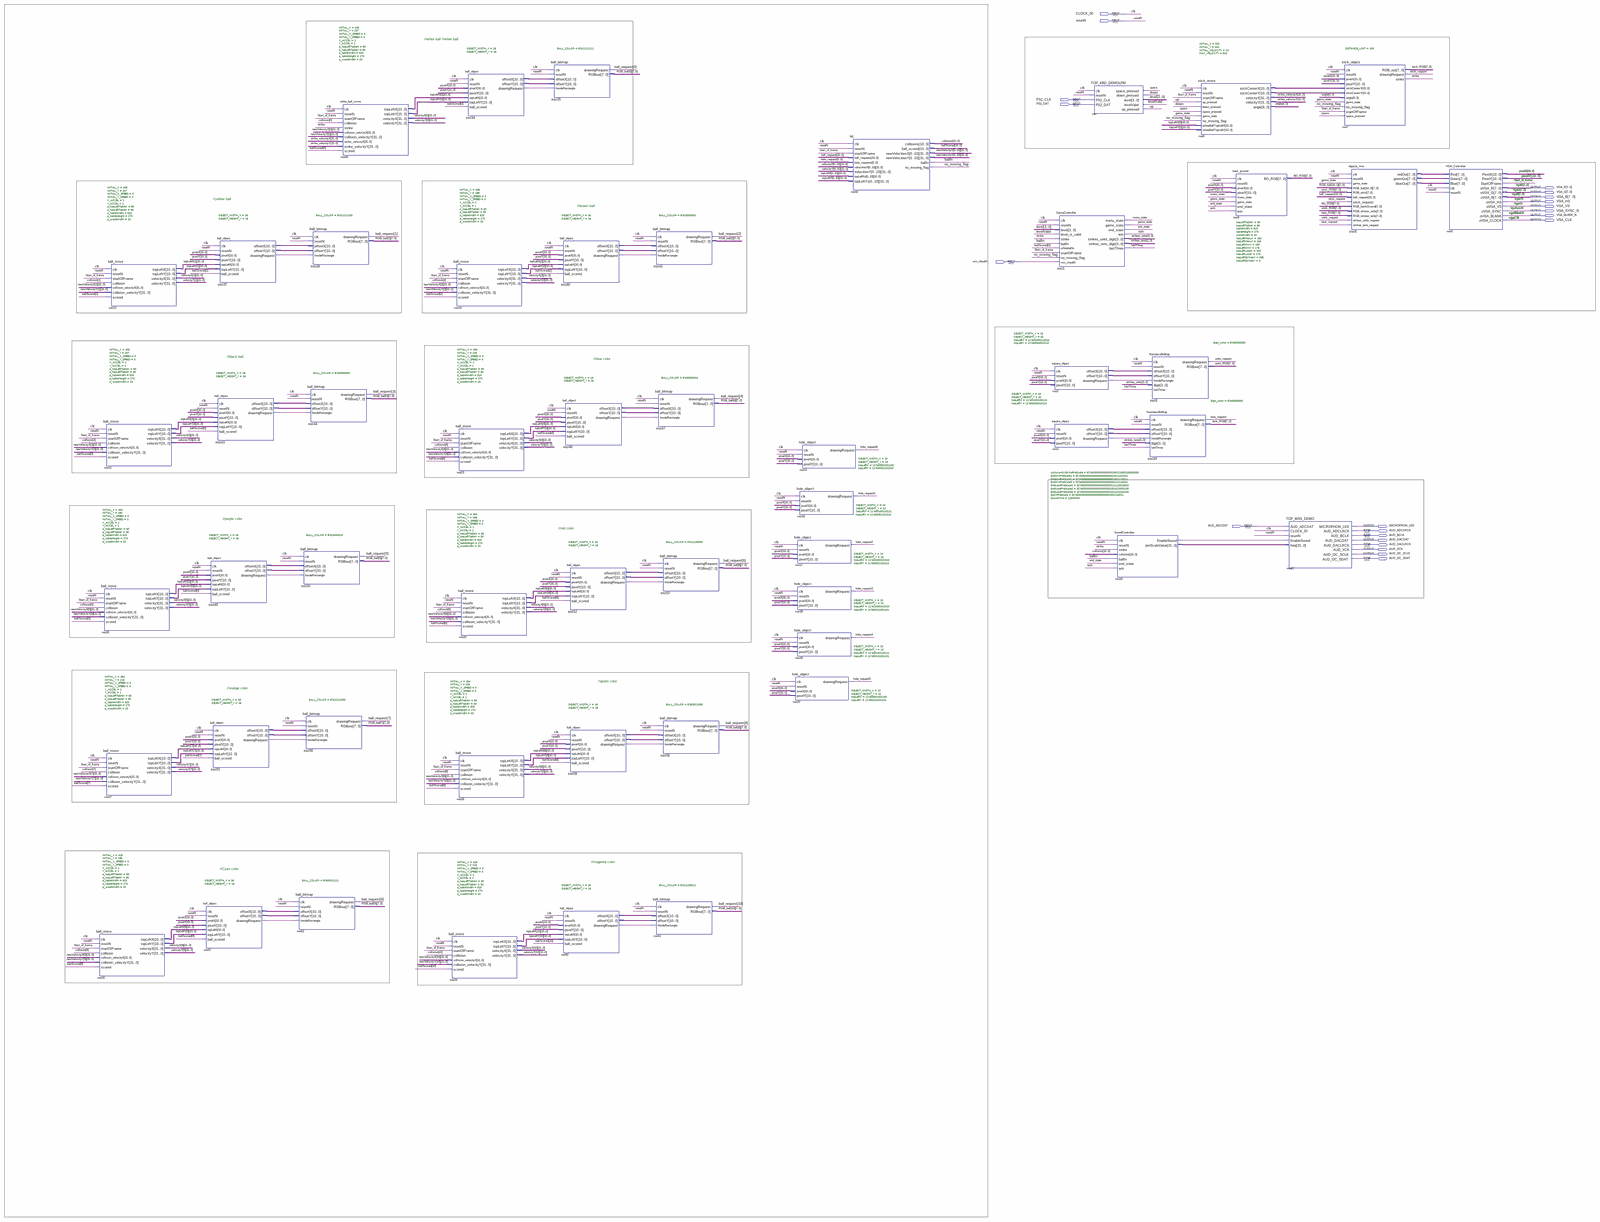
[diagram p0: schematic sheet, whole]
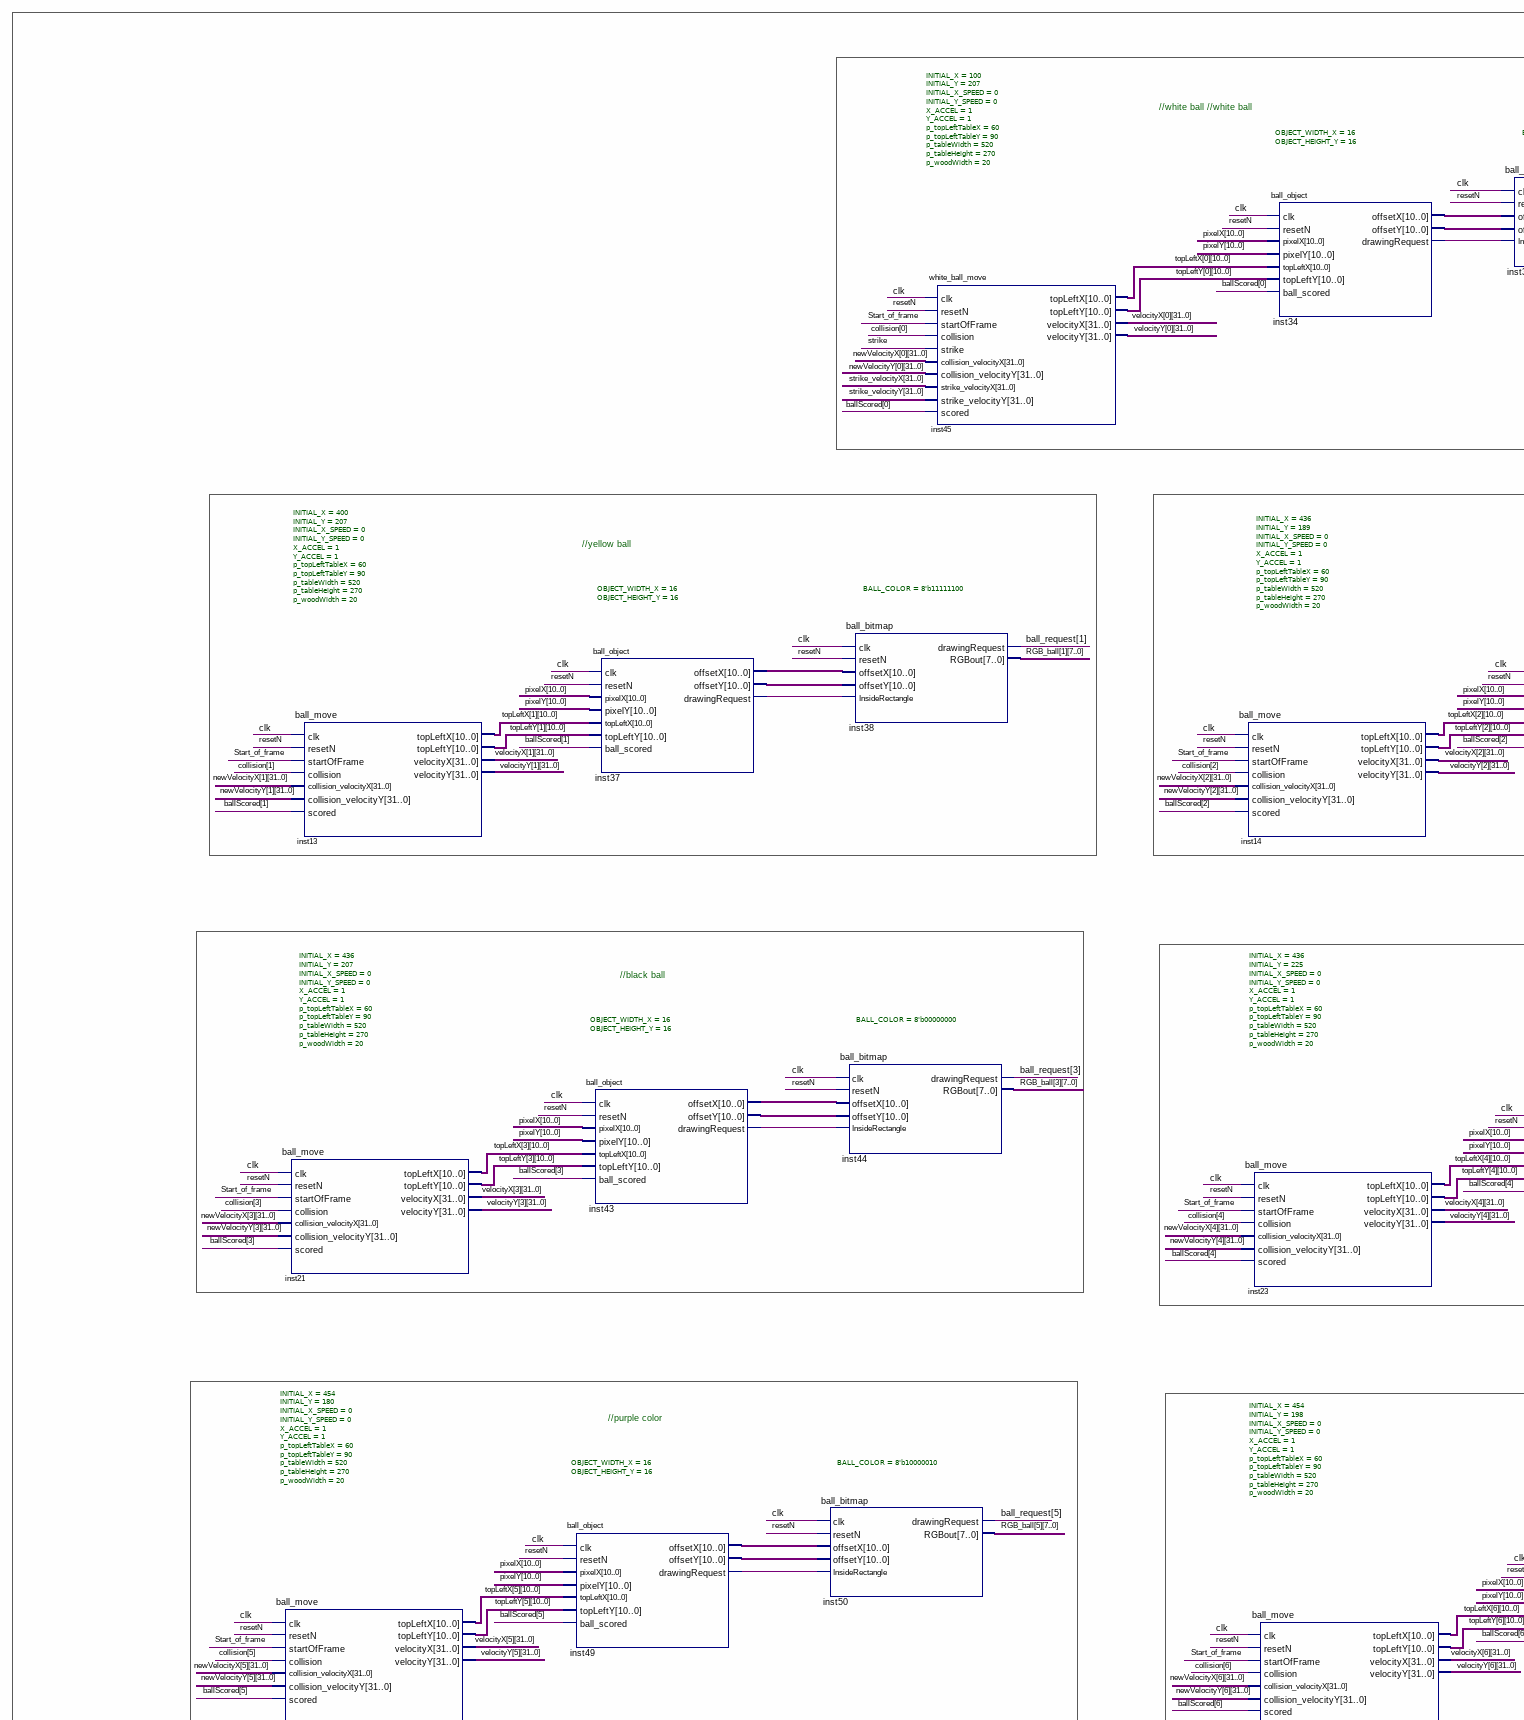
[diagram p1: schematic sheet, upper left part]
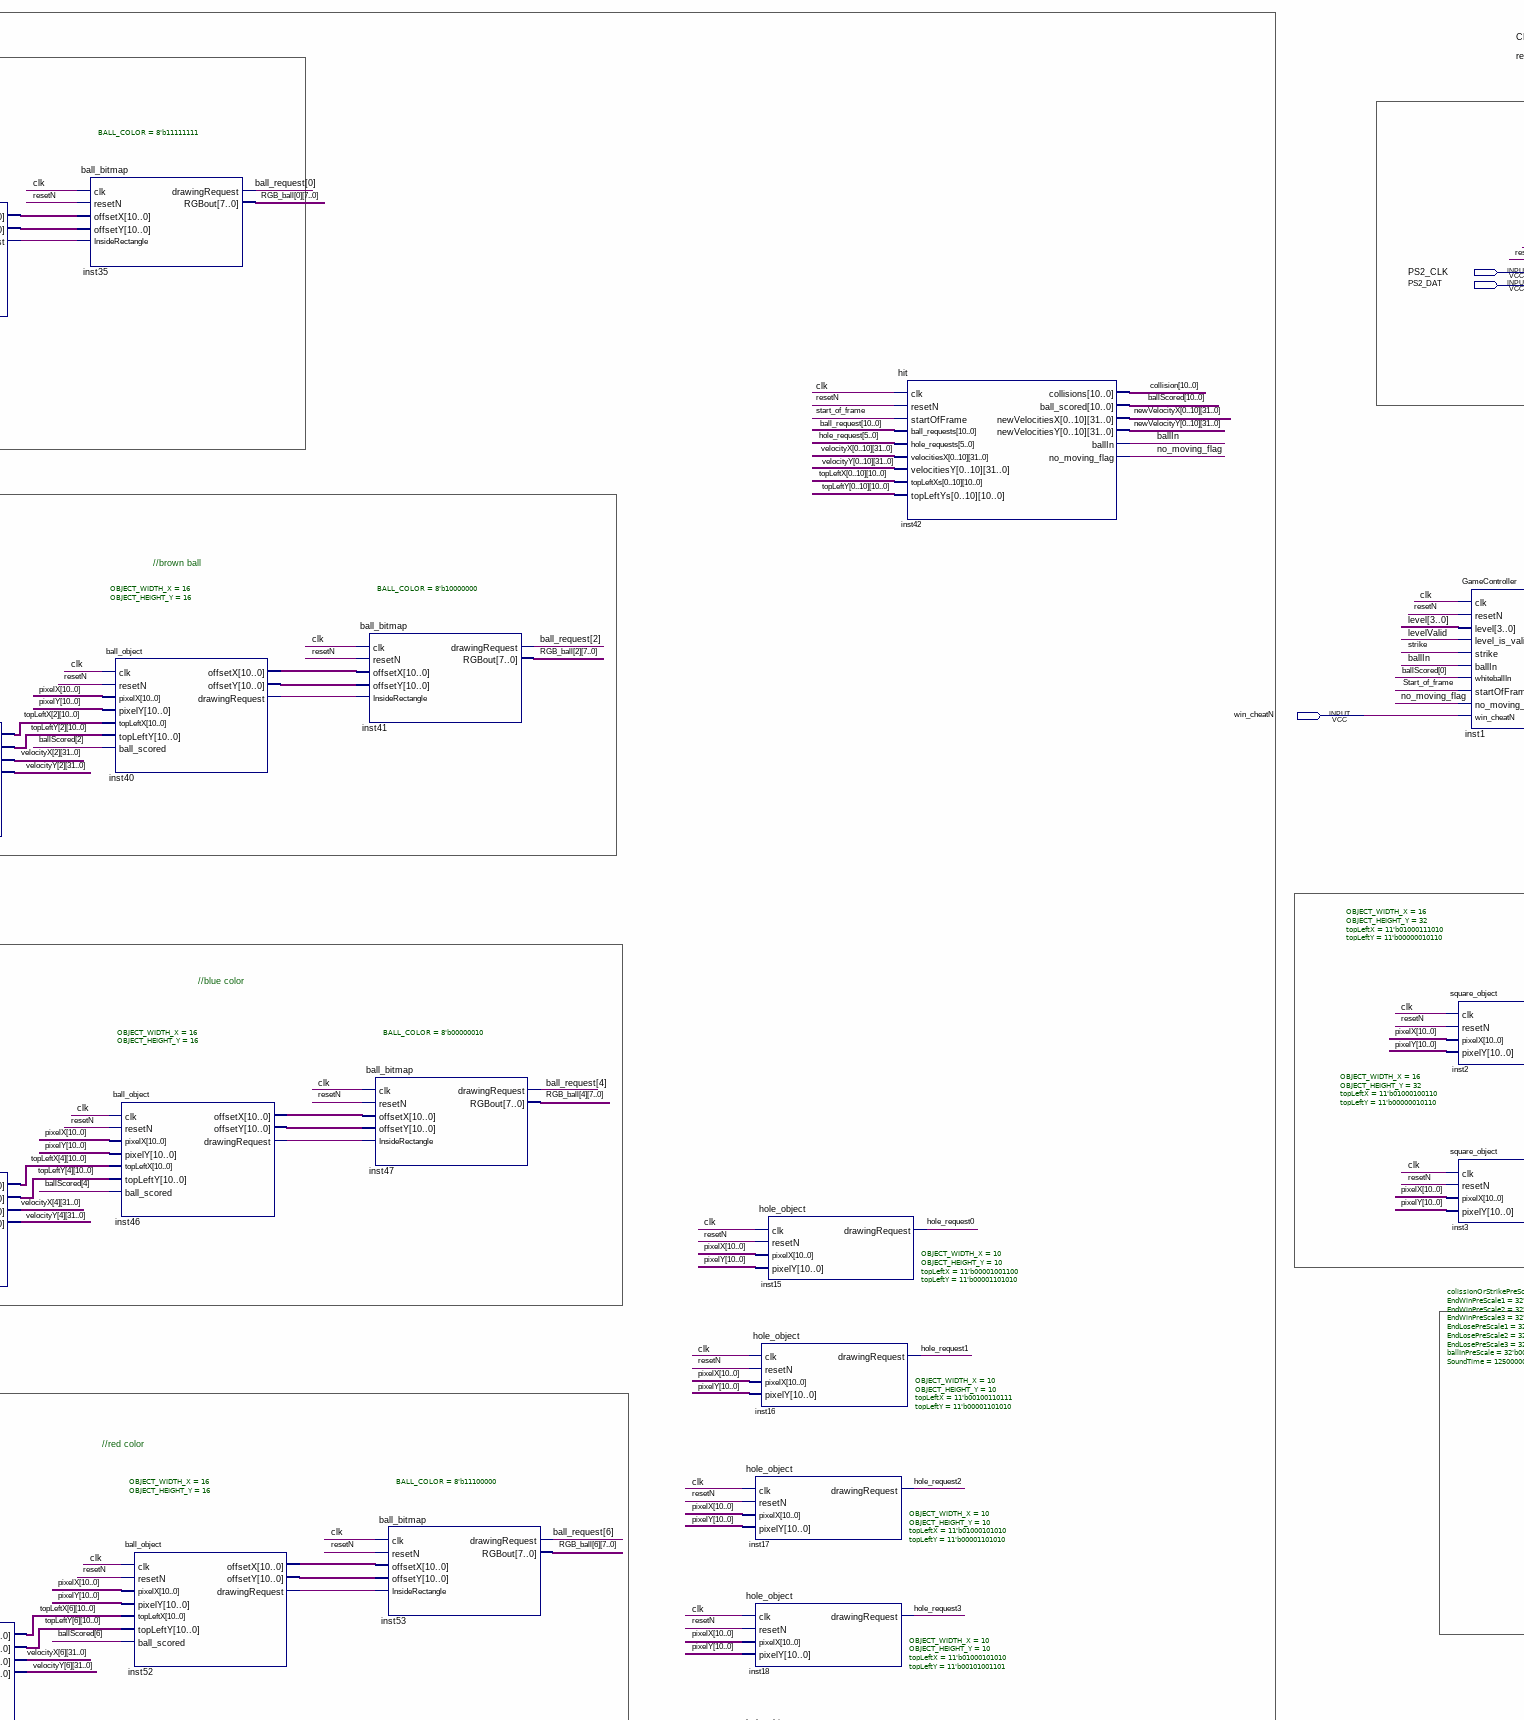
[diagram p2: schematic sheet, upper centre part]
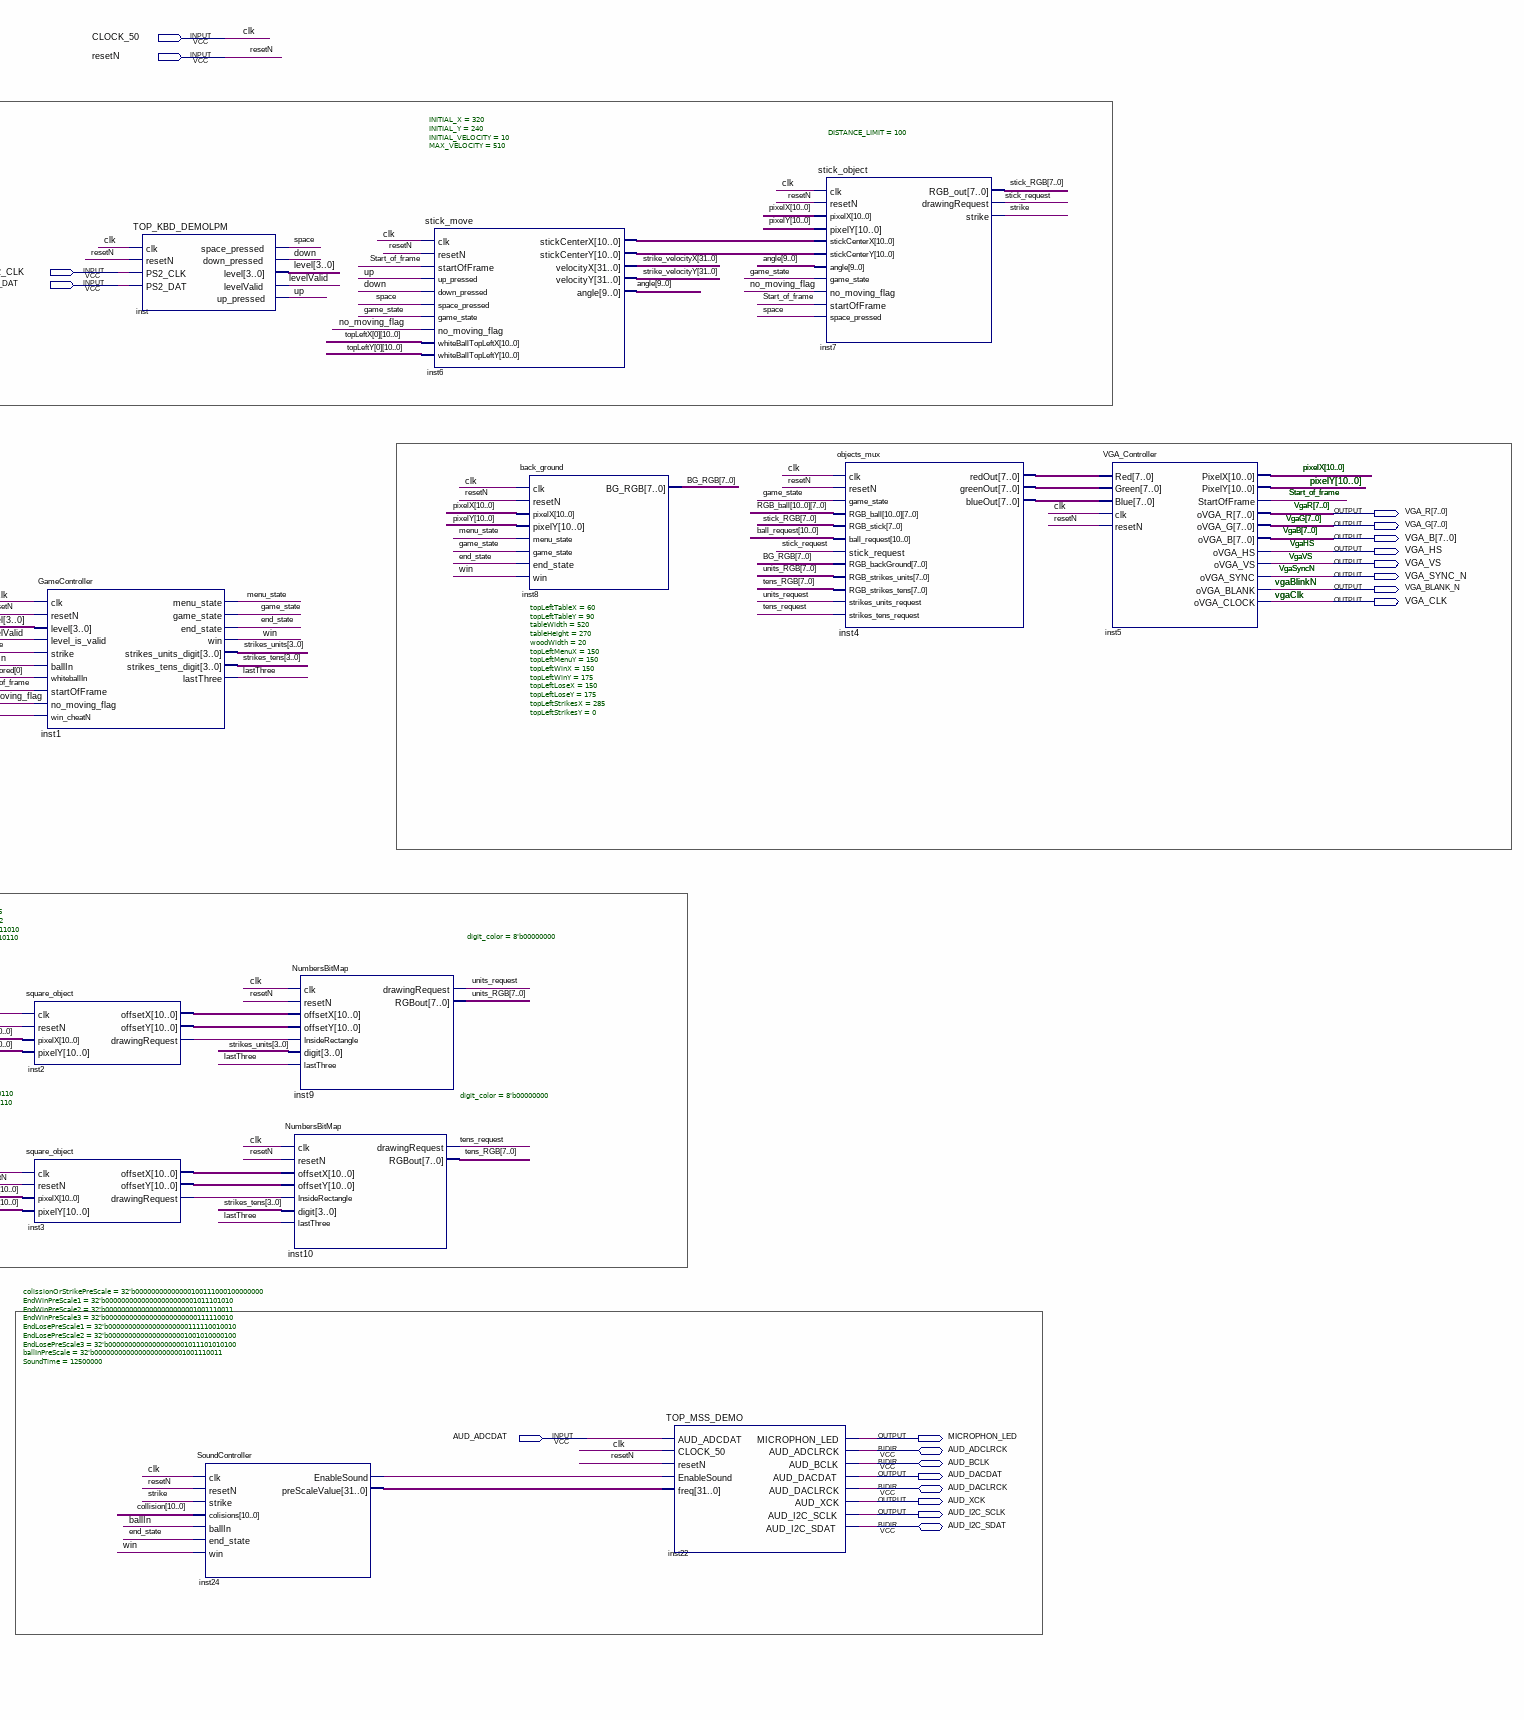
[diagram p3: schematic sheet, upper right part]
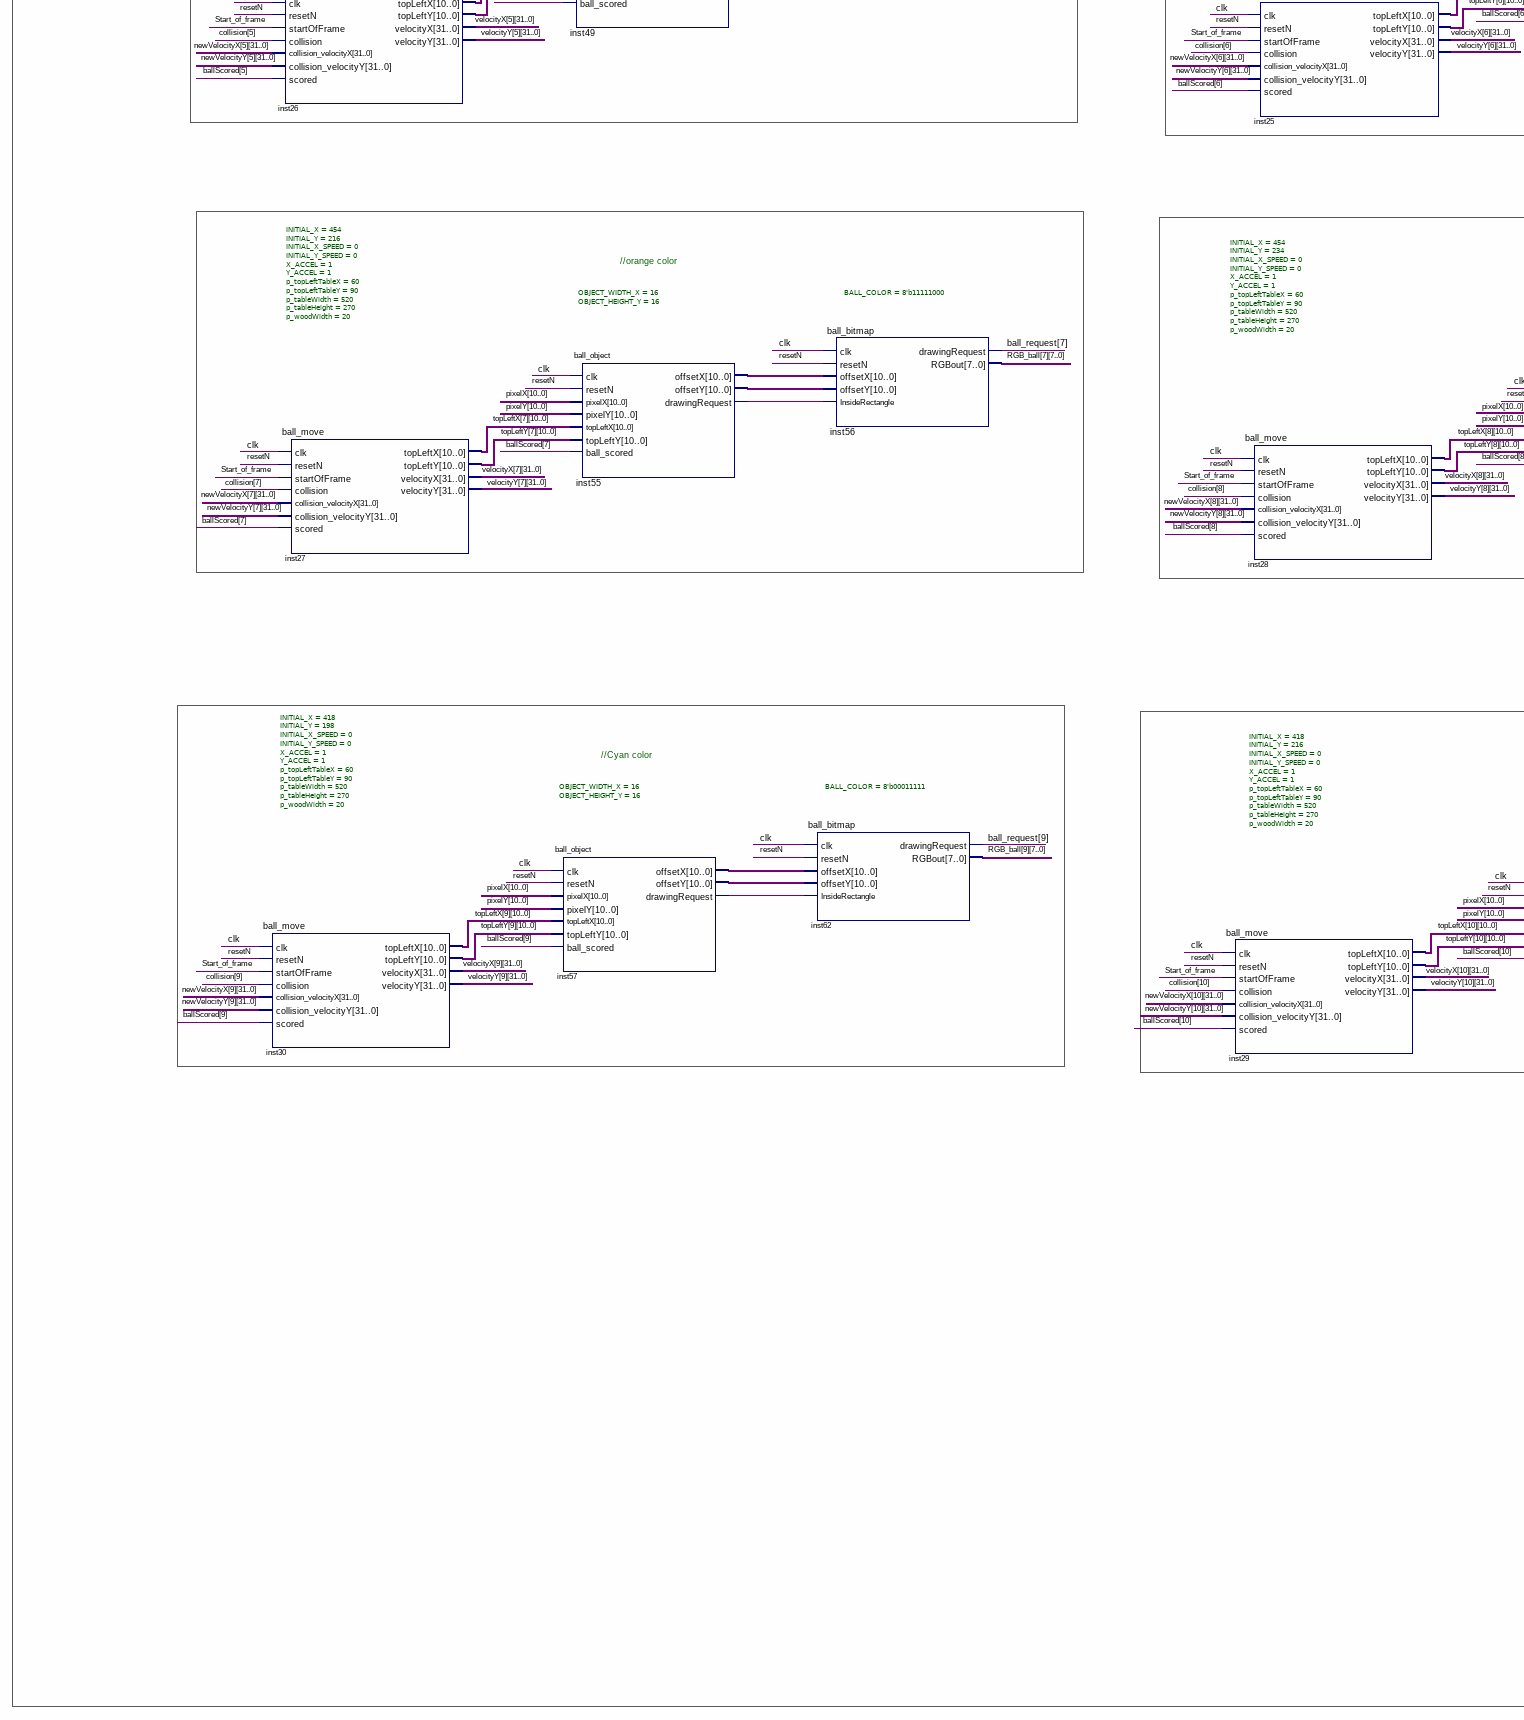
[diagram p4: schematic sheet, lower left part]
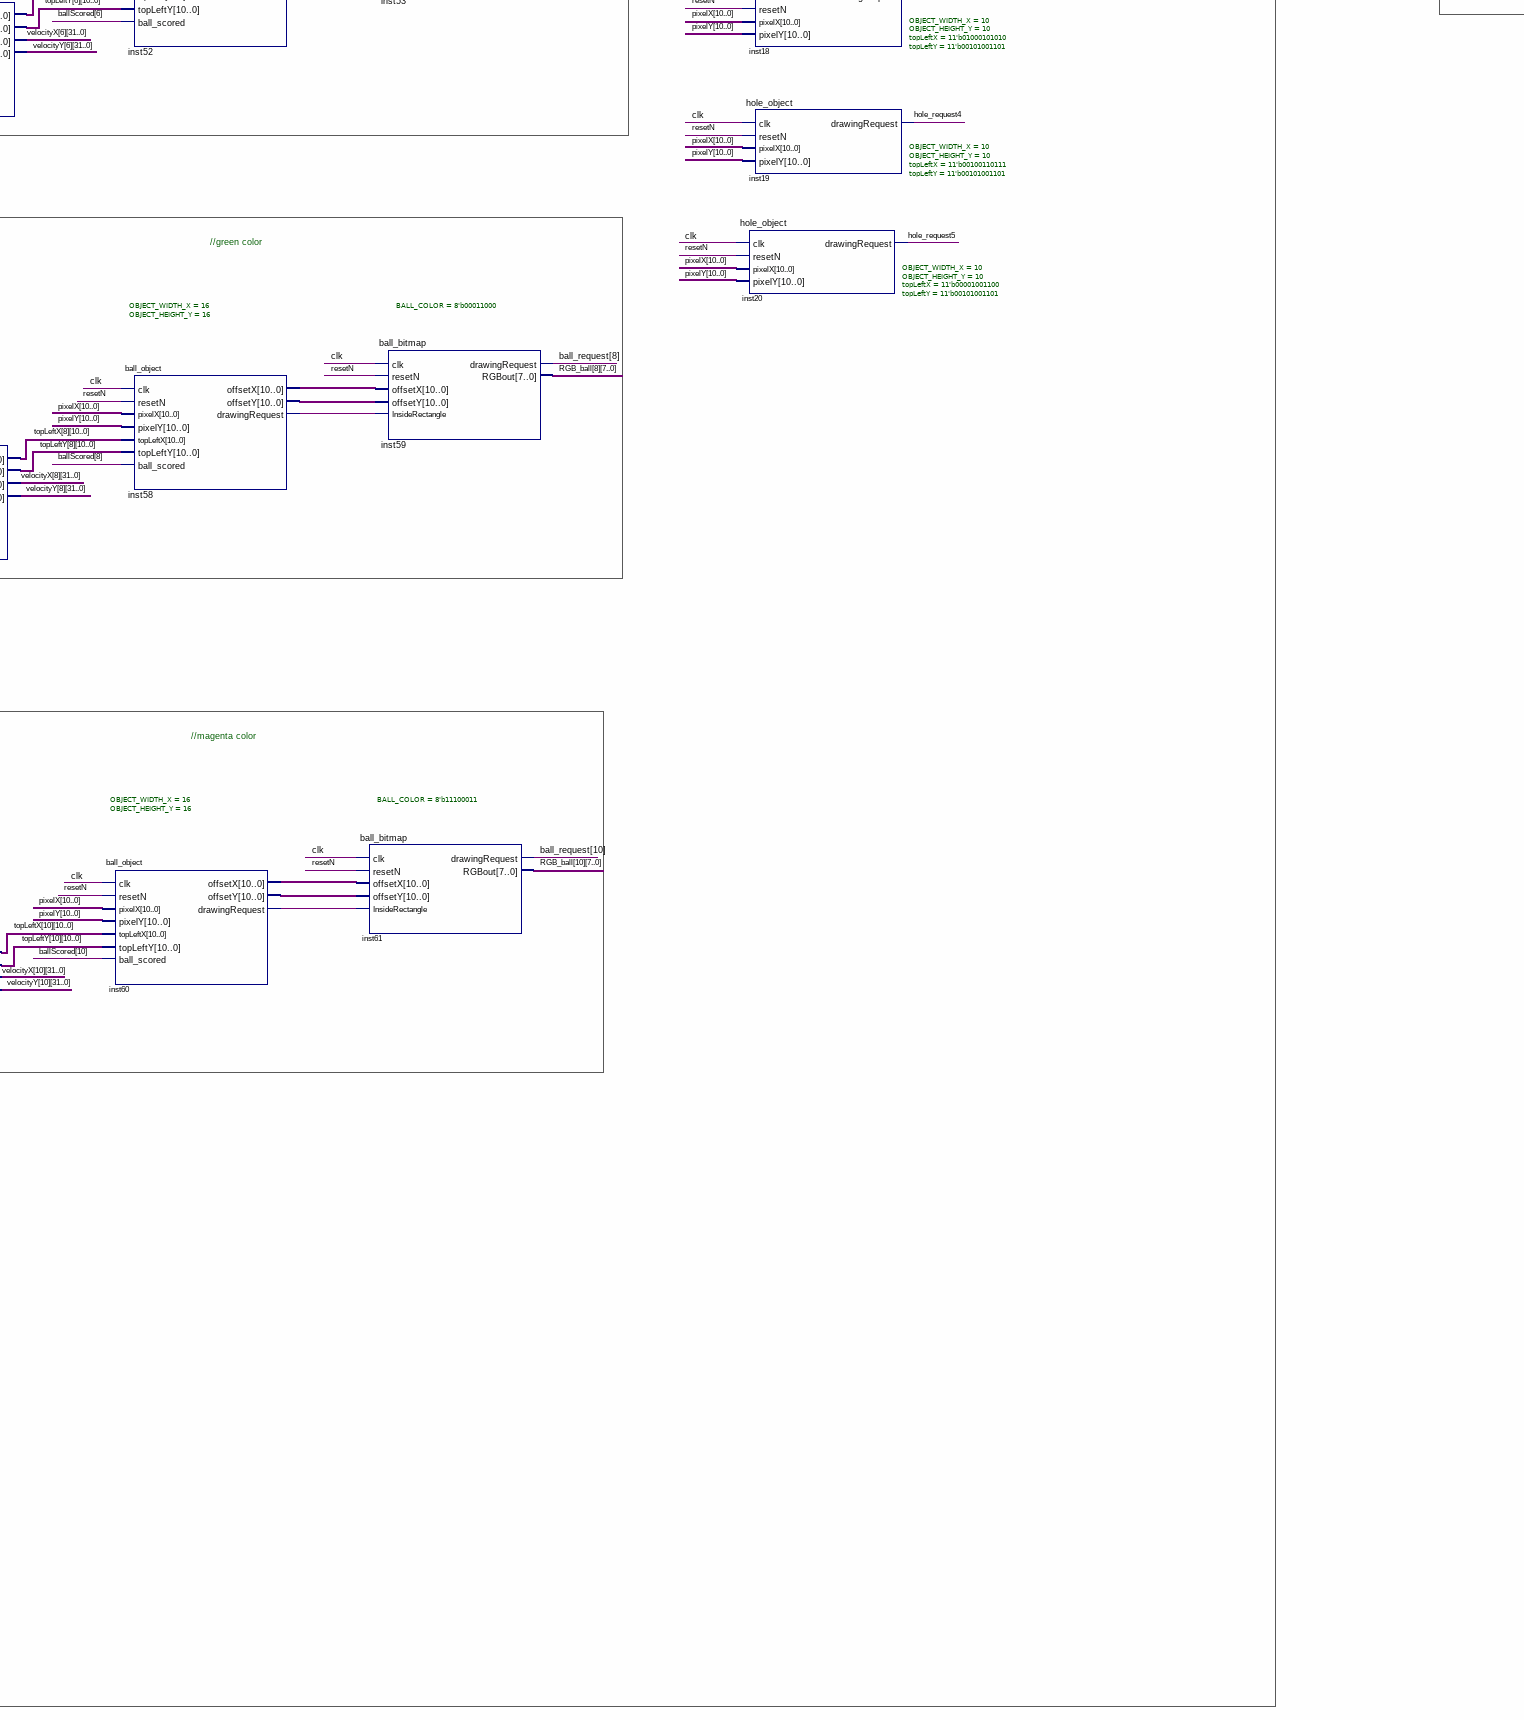
[diagram p5: schematic sheet, lower centre part]
// Quartus schematic TOP_TEST.bdf as structural Verilog: 53 symbols, 22 pins
module TOP_TEST (
  input  CLOCK_50,
  input  resetN,
  input  PS2_CLK,
  input  PS2_DAT,
  input  win_cheatN,
  input  AUD_ADCDAT,
  inout  AUD_ADCLRCK,
  inout  AUD_BCLK,
  inout  AUD_DACLRCK,
  inout  AUD_I2C_SDAT,
  output [7:0] VGA_R,
  output [7:0] VGA_G,
  output [7:0] VGA_B,
  output VGA_HS,
  output VGA_VS,
  output VGA_SYNC_N,
  output VGA_BLANK_N,
  output VGA_CLK,
  output MICROPHON_LED,
  output AUD_DACDAT,
  output AUD_XCK,
  output AUD_I2C_SCLK
);

  wire ballIn, down, end_state, game_state, inst2_drawingrequest, inst3_drawingrequest, inst24_enablesound,
       inst34_drawingrequest, inst37_drawingrequest, inst40_drawingrequest, inst43_drawingrequest,
       inst46_drawingrequest, inst49_drawingrequest, inst52_drawingrequest, inst55_drawingrequest,
       inst57_drawingrequest, inst58_drawingrequest, inst60_drawingrequest, lastThree, levelValid,
       menu_state, no_moving_flag, space, Start_of_frame, stick_request, strike, tens_request, units_request,
       up, win;
  wire [3:0] level, strikes_tens, strikes_units;
  wire [5:0] hole_request;
  wire [7:0] BG_RGB, inst4_blueout, inst4_greenout, inst4_redout, RGB_ball_0, RGB_ball_1, RGB_ball_2,
       RGB_ball_3, RGB_ball_4, RGB_ball_5, RGB_ball_6, RGB_ball_7, RGB_ball_8, RGB_ball_9, RGB_ball_10,
       stick_RGB, tens_RGB, units_RGB;
  wire [9:0] angle;
  wire [10:0] ball_request, ballScored, collision, inst2_offsetx, inst2_offsety, inst3_offsetx,
       inst3_offsety, inst6_stickcenterx, inst6_stickcentery, inst34_offsetx, inst34_offsety, inst37_offsetx,
       inst37_offsety, inst40_offsetx, inst40_offsety, inst43_offsetx, inst43_offsety, inst46_offsetx,
       inst46_offsety, inst49_offsetx, inst49_offsety, inst52_offsetx, inst52_offsety, inst55_offsetx,
       inst55_offsety, inst57_offsetx, inst57_offsety, inst58_offsetx, inst58_offsety, inst60_offsetx,
       inst60_offsety, pixelX, pixelY, topLeftX_0, topLeftX_1, topLeftX_2, topLeftX_3, topLeftX_4,
       topLeftX_5, topLeftX_6, topLeftX_7, topLeftX_8, topLeftX_9, topLeftX_10, topLeftY_0, topLeftY_1,
       topLeftY_2, topLeftY_3, topLeftY_4, topLeftY_5, topLeftY_6, topLeftY_7, topLeftY_8, topLeftY_9,
       topLeftY_10;
  wire [31:0] inst24_prescalevalue, newVelocityX_0, newVelocityX_1, newVelocityX_2, newVelocityX_3,
       newVelocityX_4, newVelocityX_5, newVelocityX_6, newVelocityX_7, newVelocityX_8, newVelocityX_9,
       newVelocityX_10, newVelocityY_0, newVelocityY_1, newVelocityY_2, newVelocityY_3, newVelocityY_4,
       newVelocityY_5, newVelocityY_6, newVelocityY_7, newVelocityY_8, newVelocityY_9, newVelocityY_10,
       strike_velocityX, strike_velocityY, velocityX_0, velocityX_1, velocityX_2, velocityX_3, velocityX_4,
       velocityX_5, velocityX_6, velocityX_7, velocityX_8, velocityX_9, velocityX_10, velocityY_0,
       velocityY_1, velocityY_2, velocityY_3, velocityY_4, velocityY_5, velocityY_6, velocityY_7,
       velocityY_8, velocityY_9, velocityY_10;

  ball_move #(.INITIAL_X(400), .INITIAL_Y(207), .INITIAL_X_SPEED(0), .INITIAL_Y_SPEED(0), .X_ACCEL(1), .Y_ACCEL(1), .p_topLeftTableX(60), .p_topLeftTableY(90), .p_tableWidth(520), .p_tableHeight(270), .p_woodWidth(20)) inst13 (
    .clk(CLOCK_50), .resetN(resetN), .startOfFrame(Start_of_frame), .collision(collision[1]),
    .collision_velocityX(newVelocityX_1), .collision_velocityY(newVelocityY_1), .scored(ballScored[1]),
    .topLeftX(topLeftX_1), .topLeftY(topLeftY_1), .velocityX(velocityX_1), .velocityY(velocityY_1));
  ball_move #(.INITIAL_X(436), .INITIAL_Y(207), .INITIAL_X_SPEED(0), .INITIAL_Y_SPEED(0), .X_ACCEL(1), .Y_ACCEL(1), .p_topLeftTableX(60), .p_topLeftTableY(90), .p_tableWidth(520), .p_tableHeight(270), .p_woodWidth(20)) inst21 (
    .clk(CLOCK_50), .resetN(resetN), .startOfFrame(Start_of_frame), .collision(collision[3]),
    .collision_velocityX(newVelocityX_3), .collision_velocityY(newVelocityY_3), .scored(ballScored[3]),
    .topLeftX(topLeftX_3), .topLeftY(topLeftY_3), .velocityX(velocityX_3), .velocityY(velocityY_3));
  ball_move #(.INITIAL_X(454), .INITIAL_Y(180), .INITIAL_X_SPEED(0), .INITIAL_Y_SPEED(0), .X_ACCEL(1), .Y_ACCEL(1), .p_topLeftTableX(60), .p_topLeftTableY(90), .p_tableWidth(520), .p_tableHeight(270), .p_woodWidth(20)) inst26 (
    .clk(CLOCK_50), .resetN(resetN), .startOfFrame(Start_of_frame), .collision(collision[5]),
    .collision_velocityX(newVelocityX_5), .collision_velocityY(newVelocityY_5), .scored(ballScored[5]),
    .topLeftX(topLeftX_5), .topLeftY(topLeftY_5), .velocityX(velocityX_5), .velocityY(velocityY_5));
  ball_move #(.INITIAL_X(454), .INITIAL_Y(216), .INITIAL_X_SPEED(0), .INITIAL_Y_SPEED(0), .X_ACCEL(1), .Y_ACCEL(1), .p_topLeftTableX(60), .p_topLeftTableY(90), .p_tableWidth(520), .p_tableHeight(270), .p_woodWidth(20)) inst27 (
    .clk(CLOCK_50), .resetN(resetN), .startOfFrame(Start_of_frame), .collision(collision[7]),
    .collision_velocityX(newVelocityX_7), .collision_velocityY(newVelocityY_7), .scored(ballScored[7]),
    .topLeftX(topLeftX_7), .topLeftY(topLeftY_7), .velocityX(velocityX_7), .velocityY(velocityY_7));
  ball_move #(.INITIAL_X(418), .INITIAL_Y(198), .INITIAL_X_SPEED(0), .INITIAL_Y_SPEED(0), .X_ACCEL(1), .Y_ACCEL(1), .p_topLeftTableX(60), .p_topLeftTableY(90), .p_tableWidth(520), .p_tableHeight(270), .p_woodWidth(20)) inst30 (
    .clk(CLOCK_50), .resetN(resetN), .startOfFrame(Start_of_frame), .collision(collision[9]),
    .collision_velocityX(newVelocityX_9), .collision_velocityY(newVelocityY_9), .scored(ballScored[9]),
    .topLeftX(topLeftX_9), .topLeftY(topLeftY_9), .velocityX(velocityX_9), .velocityY(velocityY_9));
  ball_object #(.OBJECT_WIDTH_X(16), .OBJECT_HEIGHT_Y(16)) inst57 (
    .clk(CLOCK_50), .resetN(resetN), .pixelX(pixelX), .pixelY(pixelY), .topLeftX(topLeftX_9),
    .topLeftY(topLeftY_9), .ball_scored(ballScored[9]), .offsetX(inst57_offsetx), .offsetY(inst57_offsety),
    .drawingRequest(inst57_drawingrequest));
  ball_object #(.OBJECT_WIDTH_X(16), .OBJECT_HEIGHT_Y(16)) inst37 (
    .clk(CLOCK_50), .resetN(resetN), .pixelX(pixelX), .pixelY(pixelY), .topLeftX(topLeftX_1),
    .topLeftY(topLeftY_1), .ball_scored(ballScored[1]), .offsetX(inst37_offsetx), .offsetY(inst37_offsety),
    .drawingRequest(inst37_drawingrequest));
  ball_object #(.OBJECT_WIDTH_X(16), .OBJECT_HEIGHT_Y(16)) inst43 (
    .clk(CLOCK_50), .resetN(resetN), .pixelX(pixelX), .pixelY(pixelY), .topLeftX(topLeftX_3),
    .topLeftY(topLeftY_3), .ball_scored(ballScored[3]), .offsetX(inst43_offsetx), .offsetY(inst43_offsety),
    .drawingRequest(inst43_drawingrequest));
  ball_object #(.OBJECT_WIDTH_X(16), .OBJECT_HEIGHT_Y(16)) inst49 (
    .clk(CLOCK_50), .resetN(resetN), .pixelX(pixelX), .pixelY(pixelY), .topLeftX(topLeftX_5),
    .topLeftY(topLeftY_5), .ball_scored(ballScored[5]), .offsetX(inst49_offsetx), .offsetY(inst49_offsety),
    .drawingRequest(inst49_drawingrequest));
  ball_object #(.OBJECT_WIDTH_X(16), .OBJECT_HEIGHT_Y(16)) inst55 (
    .clk(CLOCK_50), .resetN(resetN), .pixelX(pixelX), .pixelY(pixelY), .topLeftX(topLeftX_7),
    .topLeftY(topLeftY_7), .ball_scored(ballScored[7]), .offsetX(inst55_offsetx), .offsetY(inst55_offsety),
    .drawingRequest(inst55_drawingrequest));
  ball_bitmap #(.BALL_COLOR(8'b00011111)) inst62 (
    .clk(CLOCK_50), .resetN(resetN), .offsetX(inst57_offsetx), .offsetY(inst57_offsety),
    .InsideRectangle(inst57_drawingrequest), .drawingRequest(ball_request[9]), .RGBout(RGB_ball_9));
  ball_bitmap #(.BALL_COLOR(8'b11111100)) inst38 (
    .clk(CLOCK_50), .resetN(resetN), .offsetX(inst37_offsetx), .offsetY(inst37_offsety),
    .InsideRectangle(inst37_drawingrequest), .drawingRequest(ball_request[1]), .RGBout(RGB_ball_1));
  ball_bitmap #(.BALL_COLOR(8'b00000000)) inst44 (
    .clk(CLOCK_50), .resetN(resetN), .offsetX(inst43_offsetx), .offsetY(inst43_offsety),
    .InsideRectangle(inst43_drawingrequest), .drawingRequest(ball_request[3]), .RGBout(RGB_ball_3));
  ball_bitmap #(.BALL_COLOR(8'b10000010)) inst50 (
    .clk(CLOCK_50), .resetN(resetN), .offsetX(inst49_offsetx), .offsetY(inst49_offsety),
    .InsideRectangle(inst49_drawingrequest), .drawingRequest(ball_request[5]), .RGBout(RGB_ball_5));
  ball_bitmap #(.BALL_COLOR(8'b11111000)) inst56 (
    .clk(CLOCK_50), .resetN(resetN), .offsetX(inst55_offsetx), .offsetY(inst55_offsety),
    .InsideRectangle(inst55_drawingrequest), .drawingRequest(ball_request[7]), .RGBout(RGB_ball_7));
  white_ball_move #(.INITIAL_X(100), .INITIAL_Y(207), .INITIAL_X_SPEED(0), .INITIAL_Y_SPEED(0), .X_ACCEL(1), .Y_ACCEL(1), .p_topLeftTableX(60), .p_topLeftTableY(90), .p_tableWidth(520), .p_tableHeight(270), .p_woodWidth(20)) inst45 (
    .clk(CLOCK_50), .resetN(resetN), .startOfFrame(Start_of_frame), .collision(collision[0]),
    .strike(strike), .collision_velocityX(newVelocityX_0), .collision_velocityY(newVelocityY_0),
    .strike_velocityX(strike_velocityX), .strike_velocityY(strike_velocityY), .scored(ballScored[0]),
    .topLeftX(topLeftX_0), .topLeftY(topLeftY_0), .velocityX(velocityX_0), .velocityY(velocityY_0));
  ball_object #(.OBJECT_WIDTH_X(16), .OBJECT_HEIGHT_Y(16)) inst34 (
    .clk(CLOCK_50), .resetN(resetN), .pixelX(pixelX), .pixelY(pixelY), .topLeftX(topLeftX_0),
    .topLeftY(topLeftY_0), .ball_scored(ballScored[0]), .offsetX(inst34_offsetx), .offsetY(inst34_offsety),
    .drawingRequest(inst34_drawingrequest));
  ball_move #(.INITIAL_X(436), .INITIAL_Y(189), .INITIAL_X_SPEED(0), .INITIAL_Y_SPEED(0), .X_ACCEL(1), .Y_ACCEL(1), .p_topLeftTableX(60), .p_topLeftTableY(90), .p_tableWidth(520), .p_tableHeight(270), .p_woodWidth(20)) inst14 (
    .clk(CLOCK_50), .resetN(resetN), .startOfFrame(Start_of_frame), .collision(collision[2]),
    .collision_velocityX(newVelocityX_2), .collision_velocityY(newVelocityY_2), .scored(ballScored[2]),
    .topLeftX(topLeftX_2), .topLeftY(topLeftY_2), .velocityX(velocityX_2), .velocityY(velocityY_2));
  ball_move #(.INITIAL_X(436), .INITIAL_Y(225), .INITIAL_X_SPEED(0), .INITIAL_Y_SPEED(0), .X_ACCEL(1), .Y_ACCEL(1), .p_topLeftTableX(60), .p_topLeftTableY(90), .p_tableWidth(520), .p_tableHeight(270), .p_woodWidth(20)) inst23 (
    .clk(CLOCK_50), .resetN(resetN), .startOfFrame(Start_of_frame), .collision(collision[4]),
    .collision_velocityX(newVelocityX_4), .collision_velocityY(newVelocityY_4), .scored(ballScored[4]),
    .topLeftX(topLeftX_4), .topLeftY(topLeftY_4), .velocityX(velocityX_4), .velocityY(velocityY_4));
  ball_move #(.INITIAL_X(454), .INITIAL_Y(198), .INITIAL_X_SPEED(0), .INITIAL_Y_SPEED(0), .X_ACCEL(1), .Y_ACCEL(1), .p_topLeftTableX(60), .p_topLeftTableY(90), .p_tableWidth(520), .p_tableHeight(270), .p_woodWidth(20)) inst25 (
    .clk(CLOCK_50), .resetN(resetN), .startOfFrame(Start_of_frame), .collision(collision[6]),
    .collision_velocityX(newVelocityX_6), .collision_velocityY(newVelocityY_6), .scored(ballScored[6]),
    .topLeftX(topLeftX_6), .topLeftY(topLeftY_6), .velocityX(velocityX_6), .velocityY(velocityY_6));
  ball_move #(.INITIAL_X(454), .INITIAL_Y(234), .INITIAL_X_SPEED(0), .INITIAL_Y_SPEED(0), .X_ACCEL(1), .Y_ACCEL(1), .p_topLeftTableX(60), .p_topLeftTableY(90), .p_tableWidth(520), .p_tableHeight(270), .p_woodWidth(20)) inst28 (
    .clk(CLOCK_50), .resetN(resetN), .startOfFrame(Start_of_frame), .collision(collision[8]),
    .collision_velocityX(newVelocityX_8), .collision_velocityY(newVelocityY_8), .scored(ballScored[8]),
    .topLeftX(topLeftX_8), .topLeftY(topLeftY_8), .velocityX(velocityX_8), .velocityY(velocityY_8));
  ball_move #(.INITIAL_X(418), .INITIAL_Y(216), .INITIAL_X_SPEED(0), .INITIAL_Y_SPEED(0), .X_ACCEL(1), .Y_ACCEL(1), .p_topLeftTableX(60), .p_topLeftTableY(90), .p_tableWidth(520), .p_tableHeight(270), .p_woodWidth(20)) inst29 (
    .clk(CLOCK_50), .resetN(resetN), .startOfFrame(Start_of_frame), .collision(collision[10]),
    .collision_velocityX(newVelocityX_10), .collision_velocityY(newVelocityY_10), .scored(ballScored[10]),
    .topLeftX(topLeftX_10), .topLeftY(topLeftY_10), .velocityX(velocityX_10), .velocityY(velocityY_10));
  ball_bitmap #(.BALL_COLOR(8'b11111111)) inst35 (
    .clk(CLOCK_50), .resetN(resetN), .offsetX(inst34_offsetx), .offsetY(inst34_offsety),
    .InsideRectangle(inst34_drawingrequest), .drawingRequest(ball_request[0]), .RGBout(RGB_ball_0));
  ball_object #(.OBJECT_WIDTH_X(16), .OBJECT_HEIGHT_Y(16)) inst40 (
    .clk(CLOCK_50), .resetN(resetN), .pixelX(pixelX), .pixelY(pixelY), .topLeftX(topLeftX_2),
    .topLeftY(topLeftY_2), .ball_scored(ballScored[2]), .offsetX(inst40_offsetx), .offsetY(inst40_offsety),
    .drawingRequest(inst40_drawingrequest));
  ball_object #(.OBJECT_WIDTH_X(16), .OBJECT_HEIGHT_Y(16)) inst46 (
    .clk(CLOCK_50), .resetN(resetN), .pixelX(pixelX), .pixelY(pixelY), .topLeftX(topLeftX_4),
    .topLeftY(topLeftY_4), .ball_scored(ballScored[4]), .offsetX(inst46_offsetx), .offsetY(inst46_offsety),
    .drawingRequest(inst46_drawingrequest));
  ball_object #(.OBJECT_WIDTH_X(16), .OBJECT_HEIGHT_Y(16)) inst52 (
    .clk(CLOCK_50), .resetN(resetN), .pixelX(pixelX), .pixelY(pixelY), .topLeftX(topLeftX_6),
    .topLeftY(topLeftY_6), .ball_scored(ballScored[6]), .offsetX(inst52_offsetx), .offsetY(inst52_offsety),
    .drawingRequest(inst52_drawingrequest));
  ball_object #(.OBJECT_WIDTH_X(16), .OBJECT_HEIGHT_Y(16)) inst58 (
    .clk(CLOCK_50), .resetN(resetN), .pixelX(pixelX), .pixelY(pixelY), .topLeftX(topLeftX_8),
    .topLeftY(topLeftY_8), .ball_scored(ballScored[8]), .offsetX(inst58_offsetx), .offsetY(inst58_offsety),
    .drawingRequest(inst58_drawingrequest));
  ball_object #(.OBJECT_WIDTH_X(16), .OBJECT_HEIGHT_Y(16)) inst60 (
    .clk(CLOCK_50), .resetN(resetN), .pixelX(pixelX), .pixelY(pixelY), .topLeftX(topLeftX_10),
    .topLeftY(topLeftY_10), .ball_scored(ballScored[10]), .offsetX(inst60_offsetx), .offsetY(inst60_offsety),
    .drawingRequest(inst60_drawingrequest));
  ball_bitmap #(.BALL_COLOR(8'b10000000)) inst41 (
    .clk(CLOCK_50), .resetN(resetN), .offsetX(inst40_offsetx), .offsetY(inst40_offsety),
    .InsideRectangle(inst40_drawingrequest), .drawingRequest(ball_request[2]), .RGBout(RGB_ball_2));
  ball_bitmap #(.BALL_COLOR(8'b00000010)) inst47 (
    .clk(CLOCK_50), .resetN(resetN), .offsetX(inst46_offsetx), .offsetY(inst46_offsety),
    .InsideRectangle(inst46_drawingrequest), .drawingRequest(ball_request[4]), .RGBout(RGB_ball_4));
  ball_bitmap #(.BALL_COLOR(8'b11100000)) inst53 (
    .clk(CLOCK_50), .resetN(resetN), .offsetX(inst52_offsetx), .offsetY(inst52_offsety),
    .InsideRectangle(inst52_drawingrequest), .drawingRequest(ball_request[6]), .RGBout(RGB_ball_6));
  ball_bitmap #(.BALL_COLOR(8'b00011000)) inst59 (
    .clk(CLOCK_50), .resetN(resetN), .offsetX(inst58_offsetx), .offsetY(inst58_offsety),
    .InsideRectangle(inst58_drawingrequest), .drawingRequest(ball_request[8]), .RGBout(RGB_ball_8));
  ball_bitmap #(.BALL_COLOR(8'b11100011)) inst61 (
    .clk(CLOCK_50), .resetN(resetN), .offsetX(inst60_offsetx), .offsetY(inst60_offsety),
    .InsideRectangle(inst60_drawingrequest), .drawingRequest(ball_request[10]), .RGBout(RGB_ball_10));
  hole_object #(.OBJECT_WIDTH_X(10), .OBJECT_HEIGHT_Y(10), .topLeftX(11'b00001001100), .topLeftY(11'b00001101010)) inst15 (
    .clk(CLOCK_50), .resetN(resetN), .pixelX(pixelX), .pixelY(pixelY), .drawingRequest(hole_request[0]));
  hole_object #(.OBJECT_WIDTH_X(10), .OBJECT_HEIGHT_Y(10), .topLeftX(11'b00100110111), .topLeftY(11'b00001101010)) inst16 (
    .clk(CLOCK_50), .resetN(resetN), .pixelX(pixelX), .pixelY(pixelY), .drawingRequest(hole_request[1]));
  hole_object #(.OBJECT_WIDTH_X(10), .OBJECT_HEIGHT_Y(10), .topLeftX(11'b01000101010), .topLeftY(11'b00001101010)) inst17 (
    .clk(CLOCK_50), .resetN(resetN), .pixelX(pixelX), .pixelY(pixelY), .drawingRequest(hole_request[2]));
  hole_object #(.OBJECT_WIDTH_X(10), .OBJECT_HEIGHT_Y(10), .topLeftX(11'b01000101010), .topLeftY(11'b00101001101)) inst18 (
    .clk(CLOCK_50), .resetN(resetN), .pixelX(pixelX), .pixelY(pixelY), .drawingRequest(hole_request[3]));
  hole_object #(.OBJECT_WIDTH_X(10), .OBJECT_HEIGHT_Y(10), .topLeftX(11'b00100110111), .topLeftY(11'b00101001101)) inst19 (
    .clk(CLOCK_50), .resetN(resetN), .pixelX(pixelX), .pixelY(pixelY), .drawingRequest(hole_request[4]));
  hole_object #(.OBJECT_WIDTH_X(10), .OBJECT_HEIGHT_Y(10), .topLeftX(11'b00001001100), .topLeftY(11'b00101001101)) inst20 (
    .clk(CLOCK_50), .resetN(resetN), .pixelX(pixelX), .pixelY(pixelY), .drawingRequest(hole_request[5]));
  hit inst42 (
    .clk(CLOCK_50), .resetN(resetN), .startOfFrame(Start_of_frame), .ball_requests(ball_request),
    .hole_requests(hole_request),
    .velocitiesX({velocityX_0, velocityX_1, velocityX_2, velocityX_3, velocityX_4, velocityX_5, velocityX_6, velocityX_7, velocityX_8, velocityX_9, velocityX_10}),
    .velocitiesY({velocityY_0, velocityY_1, velocityY_2, velocityY_3, velocityY_4, velocityY_5, velocityY_6, velocityY_7, velocityY_8, velocityY_9, velocityY_10}),
    .topLeftXs({topLeftX_0, topLeftX_1, topLeftX_2, topLeftX_3, topLeftX_4, topLeftX_5, topLeftX_6, topLeftX_7, topLeftX_8, topLeftX_9, topLeftX_10}),
    .topLeftYs({topLeftY_0, topLeftY_1, topLeftY_2, topLeftY_3, topLeftY_4, topLeftY_5, topLeftY_6, topLeftY_7, topLeftY_8, topLeftY_9, topLeftY_10}),
    .collisions(collision), .ball_scored(ballScored),
    .newVelocitiesX({newVelocityX_0, newVelocityX_1, newVelocityX_2, newVelocityX_3, newVelocityX_4, newVelocityX_5, newVelocityX_6, newVelocityX_7, newVelocityX_8, newVelocityX_9, newVelocityX_10}),
    .newVelocitiesY({newVelocityY_0, newVelocityY_1, newVelocityY_2, newVelocityY_3, newVelocityY_4, newVelocityY_5, newVelocityY_6, newVelocityY_7, newVelocityY_8, newVelocityY_9, newVelocityY_10}),
    .ballIn(ballIn), .no_moving_flag(no_moving_flag));
  GameController inst1 (
    .clk(CLOCK_50), .resetN(resetN), .level(level), .level_is_valid(levelValid), .strike(strike),
    .ballIn(ballIn), .whiteballIn(ballScored[0]), .startOfFrame(Start_of_frame),
    .no_moving_flag(no_moving_flag), .win_cheatN(win_cheatN), .menu_state(menu_state),
    .game_state(game_state), .end_state(end_state), .win(win), .strikes_units_digit(strikes_units),
    .strikes_tens_digit(strikes_tens), .lastThree(lastThree));
  square_object #(.OBJECT_WIDTH_X(16), .OBJECT_HEIGHT_Y(32), .topLeftX(11'b01000111010), .topLeftY(11'b00000010110)) inst2 (
    .clk(CLOCK_50), .resetN(resetN), .pixelX(pixelX), .pixelY(pixelY), .offsetX(inst2_offsetx),
    .offsetY(inst2_offsety), .drawingRequest(inst2_drawingrequest));
  square_object #(.OBJECT_WIDTH_X(16), .OBJECT_HEIGHT_Y(32), .topLeftX(11'b01000100110), .topLeftY(11'b00000010110)) inst3 (
    .clk(CLOCK_50), .resetN(resetN), .pixelX(pixelX), .pixelY(pixelY), .offsetX(inst3_offsetx),
    .offsetY(inst3_offsety), .drawingRequest(inst3_drawingrequest));
  TOP_KBD_DEMOLPM inst (
    .clk(CLOCK_50), .resetN(resetN), .PS2_CLK(PS2_CLK), .PS2_DAT(PS2_DAT), .space_pressed(space),
    .down_pressed(down), .level(level), .levelValid(levelValid), .up_pressed(up));
  SoundController #(.colissionOrStrikePreScale(32'b00000000000000100111000100000000), .EndWinPreScale1(32'b00000000000000000000001011101010), .EndWinPreScale2(32'b00000000000000000000001001110011), .EndWinPreScale3(32'b00000000000000000000000111110010), .EndLosePreScale1(32'b00000000000000000000111110010010), .EndLosePreScale2(32'b00000000000000000001001010000100), .EndLosePreScale3(32'b00000000000000000001011101010100), .ballInPreScale(32'b00000000000000000000001001110011), .SoundTime(12500000)) inst24 (
    .clk(CLOCK_50), .resetN(resetN), .strike(strike), .colisions(collision), .ballIn(ballIn),
    .end_state(end_state), .win(win), .EnableSound(inst24_enablesound), .preScaleValue(inst24_prescalevalue));
  NumbersBitMap #(.digit_color(8'b00000000)) inst9 (
    .clk(CLOCK_50), .resetN(resetN), .offsetX(inst2_offsetx), .offsetY(inst2_offsety),
    .InsideRectangle(inst2_drawingrequest), .digit(strikes_units), .lastThree(lastThree),
    .drawingRequest(units_request), .RGBout(units_RGB));
  NumbersBitMap #(.digit_color(8'b00000000)) inst10 (
    .clk(CLOCK_50), .resetN(resetN), .offsetX(inst3_offsetx), .offsetY(inst3_offsety),
    .InsideRectangle(inst3_drawingrequest), .digit(strikes_tens), .lastThree(lastThree),
    .drawingRequest(tens_request), .RGBout(tens_RGB));
  stick_move #(.INITIAL_X(320), .INITIAL_Y(240), .INITIAL_VELOCITY(10), .MAX_VELOCITY(510)) inst6 (
    .clk(CLOCK_50), .resetN(resetN), .startOfFrame(Start_of_frame), .up_pressed(up), .down_pressed(down),
    .space_pressed(space), .game_state(game_state), .no_moving_flag(no_moving_flag),
    .whiteBallTopLeftX(topLeftX_0), .whiteBallTopLeftY(topLeftY_0), .stickCenterX(inst6_stickcenterx),
    .stickCenterY(inst6_stickcentery), .velocityX(strike_velocityX), .velocityY(strike_velocityY),
    .angle(angle));
  back_ground #(.topLeftTableX(60), .topLeftTableY(90), .tableWidth(520), .tableHeight(270), .woodWidth(20), .topLeftMenuX(150), .topLeftMenuY(150), .topLeftWinX(150), .topLeftWinY(175), .topLeftLoseX(150), .topLeftLoseY(175), .topLeftStrikesX(285), .topLeftStrikesY(0)) inst8 (
    .clk(CLOCK_50), .resetN(resetN), .pixelX(pixelX), .pixelY(pixelY), .menu_state(menu_state),
    .game_state(game_state), .end_state(end_state), .win(win), .BG_RGB(BG_RGB));
  TOP_MSS_DEMO inst22 (
    .AUD_ADCDAT(AUD_ADCDAT), .CLOCK_50(CLOCK_50), .resetN(resetN), .EnableSound(inst24_enablesound),
    .freq(inst24_prescalevalue), .MICROPHON_LED(MICROPHON_LED), .AUD_DACDAT(AUD_DACDAT), .AUD_XCK(AUD_XCK),
    .AUD_I2C_SCLK(AUD_I2C_SCLK), .AUD_ADCLRCK(AUD_ADCLRCK), .AUD_BCLK(AUD_BCLK), .AUD_DACLRCK(AUD_DACLRCK),
    .AUD_I2C_SDAT(AUD_I2C_SDAT));
  stick_object #(.DISTANCE_LIMIT(100)) inst7 (
    .clk(CLOCK_50), .resetN(resetN), .pixelX(pixelX), .pixelY(pixelY), .stickCenterX(inst6_stickcenterx),
    .stickCenterY(inst6_stickcentery), .angle(angle), .game_state(game_state),
    .no_moving_flag(no_moving_flag), .startOfFrame(Start_of_frame), .space_pressed(space),
    .RGB_out(stick_RGB), .drawingRequest(stick_request), .strike(strike));
  objects_mux inst4 (
    .clk(CLOCK_50), .resetN(resetN), .game_state(game_state),
    .RGB_ball({RGB_ball_10, RGB_ball_9, RGB_ball_8, RGB_ball_7, RGB_ball_6, RGB_ball_5, RGB_ball_4, RGB_ball_3, RGB_ball_2, RGB_ball_1, RGB_ball_0}),
    .RGB_stick(stick_RGB), .ball_request(ball_request), .stick_request(stick_request),
    .RGB_backGround(BG_RGB), .RGB_strikes_units(units_RGB), .RGB_strikes_tens(tens_RGB),
    .strikes_units_request(units_request), .strikes_tens_request(tens_request), .redOut(inst4_redout),
    .greenOut(inst4_greenout), .blueOut(inst4_blueout));
  VGA_Controller inst5 (
    .Red(inst4_redout), .Green(inst4_greenout), .Blue(inst4_blueout), .clk(CLOCK_50), .resetN(resetN),
    .PixelX(pixelX), .PixelY(pixelY), .StartOfFrame(Start_of_frame), .oVGA_R(VGA_R), .oVGA_G(VGA_G),
    .oVGA_B(VGA_B), .oVGA_HS(VGA_HS), .oVGA_VS(VGA_VS), .oVGA_SYNC(VGA_SYNC_N), .oVGA_BLANK(VGA_BLANK_N),
    .oVGA_CLOCK(VGA_CLK));

  // Other names for the same wires on the sheet: clk = CLOCK_50; VgaB[7:0] = VGA_B; vgaBlinkN = VGA_BLANK_N;
  //   vgaClk = VGA_CLK; VgaG[7:0] = VGA_G; VgaHS = VGA_HS; VgaR[7:0] = VGA_R; VgaSyncN = VGA_SYNC_N; VgaVS = VGA_VS

  // Notes on the sheet:
  //   //white ball //white ball
  //   pixelX[10..0]
  //   pixelY[10..0]
  //   Start_of_frame
  //   VgaR[7..0]
  //   VgaG[7..0]
  //   VgaB[7..0]
  //   //yellow ball
  //   VgaHS
  //   VgaVS
  //   //brown ball
  //   VgaSyncN
  //   vgaBlinkN
  //   vgaClk
  //   //black ball
  //   //blue color
  //   //purple color
  //   //red color
  //   //green color
  //   //orange color
  //   //magenta color
  //   //Cyan color
endmodule
